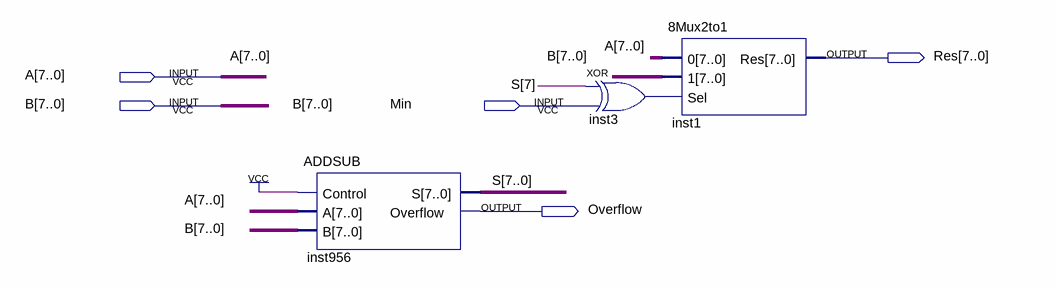
[diagram p0: schematic sheet]
// Quartus schematic MinMax.bdf as structural Verilog: 3 symbols, 5 pins
module MinMax (
  input  [7:0] A,
  input  [7:0] B,
  input  Min,
  output [7:0] Res,
  output Overflow
);

  wire inst3_out;
  wire [7:0] S;

  ADDSUB inst956 (.Control(1'b1), .A(A), .B(B), .S(S), .Overflow(Overflow));
  xor inst3 (inst3_out, S[7], Min);
  \8Mux2to1  inst1 (.\0 (A), .\1 (B), .Sel(inst3_out), .Res(Res));
endmodule
